# Altium schematic sheet Debugger.SchDoc
size B; Author: E. Sims; Organization: Let's Build Rockets Inc.; SheetNumber: 6; SheetTotal: 6
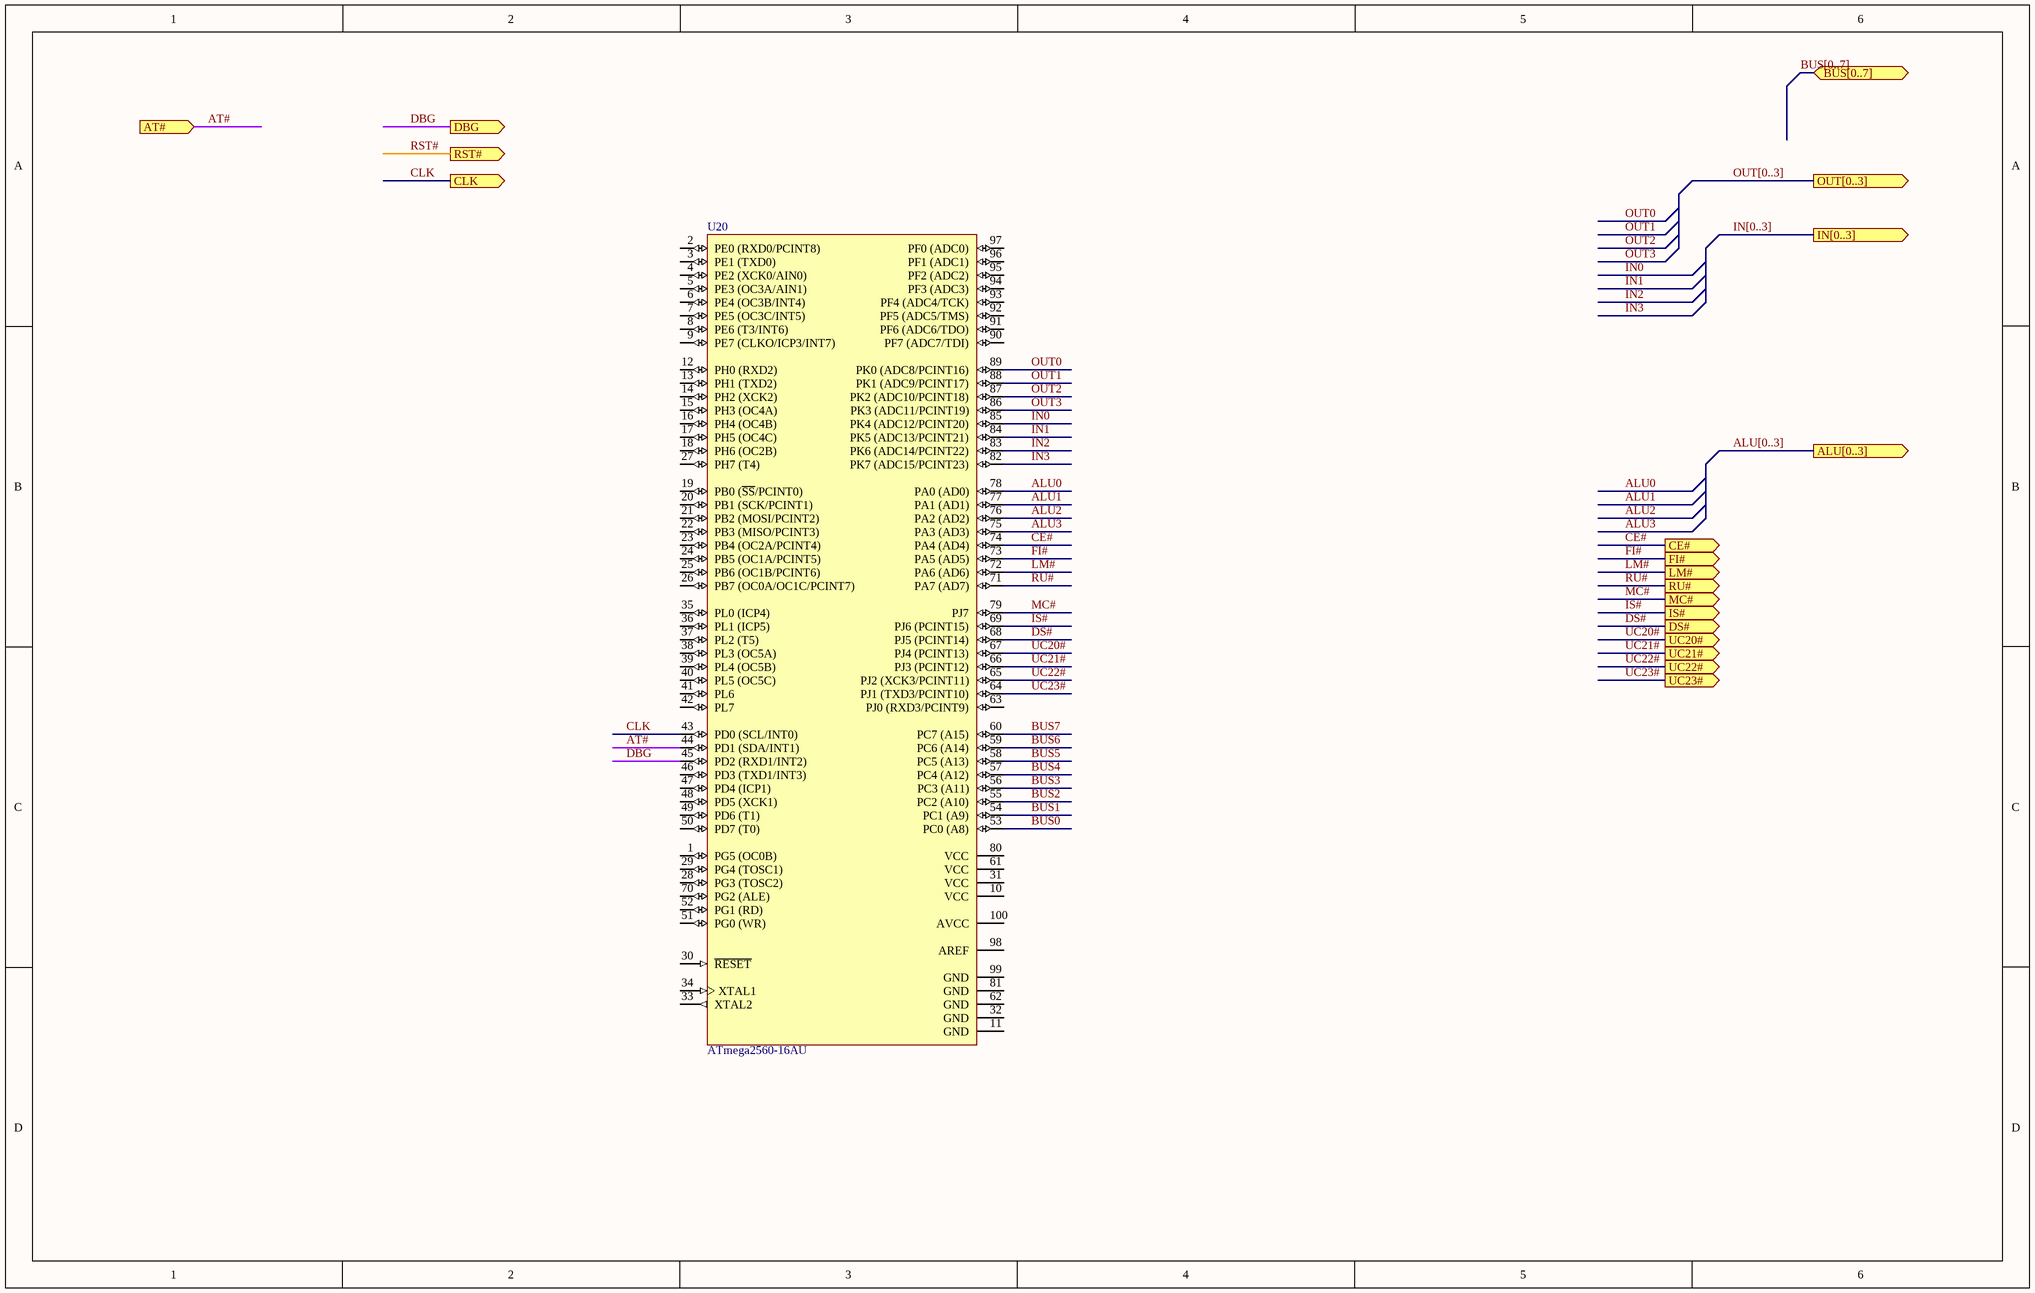
[diagram p0: Debugger.SchDoc]

## Parts
U20  ATmega2560-16AU  [100A_M]

## Ports
ALU[0..3] (out), AT# (in), BUS[0..7] (bidir), CE# (out), CLK (out), DBG (out), DS# (out), FI# (out), IN[0..3] (out), IS# (out), LM# (out), MC# (out), OUT[0..3] (out), RST# (out), RU# (out), UC20# (out), UC21# (out), UC22# (out), UC23# (out)

## Nets
ALU0: U20.78(PA0_(AD0))
ALU1: U20.77(PA1_(AD1))
ALU2: U20.76(PA2_(AD2))
ALU3: U20.75(PA3_(AD3))
AT#: U20.44(PD1_(SDA/INT1)) ; port AT#
BUS0: U20.53(PC0_(A8))
BUS1: U20.54(PC1_(A9))
BUS2: U20.55(PC2_(A10))
BUS3: U20.56(PC3_(A11))
BUS4: U20.57(PC4_(A12))
BUS5: U20.58(PC5_(A13))
BUS6: U20.59(PC6_(A14))
BUS7: U20.60(PC7_(A15))
CE#: U20.74(PA4_(AD4)) ; port CE#
CLK: U20.43(PD0_(SCL/INT0)) ; port CLK
DBG: U20.45(PD2_(RXD1/INT2)) ; port DBG
DS#: U20.68(PJ5_(PCINT14)) ; port DS#
FI#: U20.73(PA5_(AD5)) ; port FI#
IN0: U20.85(PK4_(ADC12/PCINT20))
IN1: U20.84(PK5_(ADC13/PCINT21))
IN2: U20.83(PK6_(ADC14/PCINT22))
IN3: U20.82(PK7_(ADC15/PCINT23))
IS#: U20.69(PJ6_(PCINT15)) ; port IS#
LM#: U20.72(PA6_(AD6)) ; port LM#
MC#: U20.79(PJ7) ; port MC#
OUT0: U20.89(PK0_(ADC8/PCINT16))
OUT1: U20.88(PK1_(ADC9/PCINT17))
OUT2: U20.87(PK2_(ADC10/PCINT18))
OUT3: U20.86(PK3_(ADC11/PCINT19))
RST#: port RST#
RU#: U20.71(PA7_(AD7)) ; port RU#
UC20#: U20.67(PJ4_(PCINT13)) ; port UC20#
UC21#: U20.66(PJ3_(PCINT12)) ; port UC21#
UC22#: U20.65(PJ2_(XCK3/PCINT11)) ; port UC22#
UC23#: U20.64(PJ1_(TXD3/PCINT10)) ; port UC23#

Not connected (* = marked no-connect by the designer): U20 1(PG5_(OC0B)) 2(PE0_(RXD0/PCINT8)) 3(PE1_(TXD0)) 4(PE2_(XCK0/AIN0)) 5(PE3_(OC3A/AIN1)) 6(PE4_(OC3B/INT4)) 7(PE5_(OC3C/INT5)) 8(PE6_(T3/INT6)) 9(PE7_(CLKO/ICP3/INT7)) 10(VCC) 11(GND) 12(PH0_(RXD2)) 13(PH1_(TXD2)) 14(PH2_(XCK2)) 15(PH3_(OC4A)) 16(PH4_(OC4B)) 17(PH5_(OC4C)) 18(PH6_(OC2B)) 19(PB0_(~{SS}/PCINT0)) 20(PB1_(SCK/PCINT1)) 21(PB2_(MOSI/PCINT2)) 22(PB3_(MISO/PCINT3)) 23(PB4_(OC2A/PCINT4)) 24(PB5_(OC1A/PCINT5)) 25(PB6_(OC1B/PCINT6)) 26(PB7_(OC0A/OC1C/PCINT7)) 27(PH7_(T4)) 28(PG3_(TOSC2)) 29(PG4_(TOSC1)) 30(~{RESET}) 31(VCC) 32(GND) 33(XTAL2) 34(XTAL1) 35(PL0_(ICP4)) 36(PL1_(ICP5)) 37(PL2_(T5)) 38(PL3_(OC5A)) 39(PL4_(OC5B)) 40(PL5_(OC5C)) 41(PL6) 42(PL7) 46(PD3_(TXD1/INT3)) 47(PD4_(ICP1)) 48(PD5_(XCK1)) 49(PD6_(T1)) 50(PD7_(T0)) 51(PG0_(WR)) 52(PG1_(RD)) 61(VCC) 62(GND) 63(PJ0_(RXD3/PCINT9)) 70(PG2_(ALE)) 80(VCC) 81(GND) 90(PF7_(ADC7/TDI)) 91(PF6_(ADC6/TDO)) 92(PF5_(ADC5/TMS)) 93(PF4_(ADC4/TCK)) 94(PF3_(ADC3)) 95(PF2_(ADC2)) 96(PF1_(ADC1)) 97(PF0_(ADC0)) 98(AREF) 99(GND) 100(AVCC)

## Buses and harness runs
bus ALU[0..3] = port ALU[0..3]
bus BUS[0..7] = port BUS[0..7]
bus IN[0..3] = port IN[0..3]
bus OUT[0..3] = port OUT[0..3]

## Notes on the sheet
- Let's Build Rocket's Inc. Modular Paylaod System Based on TMP-010 Rev
  For more information visit https://github.com/LetsBuildRockets/Modular-Payload-System
  This work is licensed under CC BY-NC 4.0. To view a copy of this license, visit https://creativecommons.org/licenses/by-nc/4.0
- Title
- Size:
- Date:
- Assembly Variant:
- B
- Number:
- Time:
- Revision:
- Sheet
- of
- Author:
- File:

## Library data of the parts
U20 = CMP-0095-00210-2: 8-bit AVR Microcontroller, 4.5-5.5V, 16MHz, 256KB Flash, 4KB EEPROM, 8KB SRAM, 86 GPIO pins, 100-pin TQFP, Industrial Grade (-40°C to 85°C), Pb-Free; PackageDescription: 100-Pin Thin Profile Plastic Quad Flat Pack (TQFP), 14 x 14 x 1.0 mm Body, 0.5 mm Pitch; ComponentLink1Description: Manufacturer URL; ComponentLink3URL: http://www.atmel.com/dyn/resources/prod_documents/2549S.pdf; RevisionNote: DatasheetVersion & PackageVersion updated. URLs added.; DatasheetVersion: revN, May-2011; ComponentLink2Description: ATmega640/1280/1281/2560/2561 Datasheet; PackageReference: 100A; PackageVersion: revD, Oct-2010; Code_JEDEC: MS-026-AED; ComponentLink1URL: http://www.atmel.com/; ComponentLink2URL: http://www.atmel.com/dyn/resources/prod_documents/doc2549.pdf; ComponentLink3Description: ATmega640/1280/1281/2560/2561 Summary